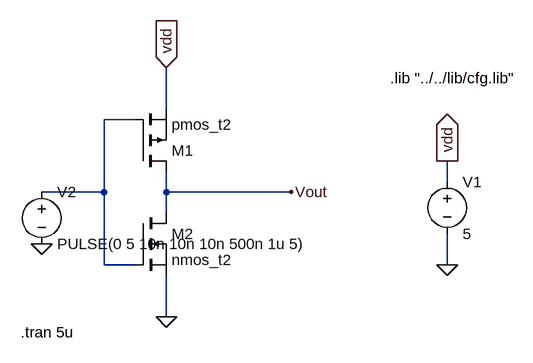
[diagram p0: schematic my_pulse_inverter.asc]
my_pulse_inverter.asc, the LTspice schematic file:
Version 4
SHEET 1 880 680
WIRE 160 48 160 -16
WIRE 112 64 64 64
WIRE 592 160 592 128
WIRE 64 176 64 64
WIRE 64 176 -32 176
WIRE 160 176 160 144
WIRE 352 176 160 176
WIRE 160 208 160 176
WIRE 64 288 64 176
WIRE 112 288 64 288
WIRE 592 288 592 240
WIRE 160 368 160 304
FLAG 352 176 Vout
FLAG 160 368 0
FLAG 160 -16 vdd
IOPIN 160 -16 In
FLAG 592 128 vdd
IOPIN 592 128 Out
FLAG 592 288 0
FLAG -32 256 0
SYMBOL pmos 112 144 M180
SYMATTR InstName M1
SYMATTR Value pmos_t2
SYMATTR Prefix X
SYMBOL nmos 112 208 R0
SYMATTR InstName M2
SYMATTR Value nmos_t2
SYMATTR Prefix X
SYMBOL voltage 592 144 R0
WINDOW 123 0 0 Left 0
WINDOW 39 0 0 Left 0
SYMATTR InstName V1
SYMATTR Value 5
SYMBOL voltage -32 160 R0
WINDOW 123 0 0 Left 0
WINDOW 39 0 0 Left 0
SYMATTR InstName V2
SYMATTR Value PULSE(0 5 10n 10n 10n 500n 1u 5)
TEXT 504 0 Left 2 !.lib "../../lib/cfg.lib"
TEXT -64 392 Left 2 !.tran 5u

The netlist it stands for:
* my_pulse_inverter.asc
XM1 Vout N001 vdd pmos_t2  ; pins D G S
XM2 Vout N001 0 nmos_t2  ; pins D G S
V1 vdd 0 5
V2 N001 0 PULSE(0 5 10n 10n 10n 500n 1u 5)
.lib "../../lib/cfg.lib"
.tran 5u
.backanno
.end